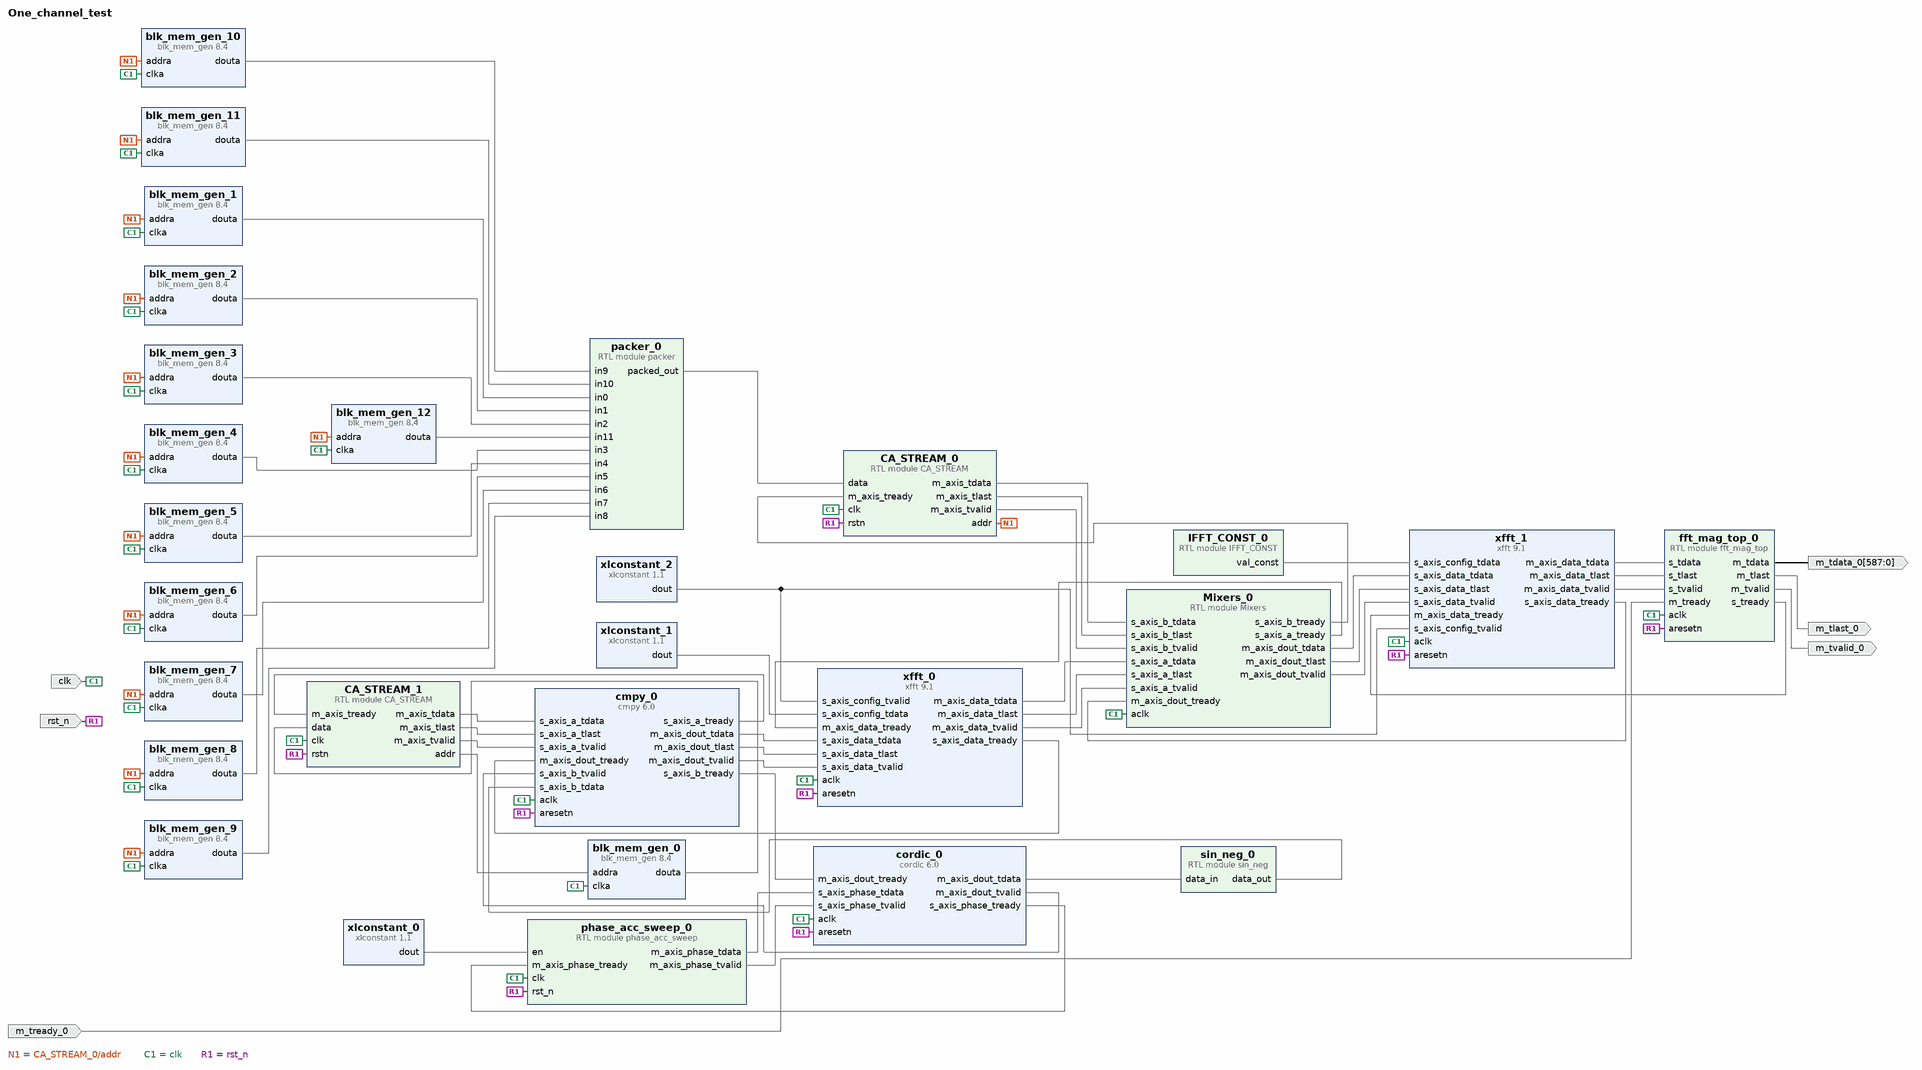
[diagram p0: block diagram of the top level]
# Vivado block design One_channel_test, xc7z020clg400-1, Vivado 2025.2
create_bd_design One_channel_test

create_bd_port -dir I -type clk clk
set_property -dict {CONFIG.FREQ_HZ 125000000} [get_bd_ports clk]
create_bd_port -dir I -type rst rst_n
create_bd_port -dir O m_tvalid_0
create_bd_port -dir O m_tlast_0
create_bd_port -dir O -from 587 -to 0 m_tdata_0
create_bd_port -dir I m_tready_0

create_bd_cell -type module -reference CA_STREAM CA_STREAM_1
set_property -dict {CONFIG.NUM_CHANNELS 1} [get_bd_cells CA_STREAM_1]
create_bd_cell -type module -reference IFFT_CONST IFFT_CONST_0
create_bd_cell -type module -reference Mixers Mixers_0
create_bd_cell -type ip -vlnv xilinx.com:ip:blk_mem_gen:8.4 blk_mem_gen_0
set_property -dict [list \
  CONFIG.Coe_File d:/fft_core/signal_iq.coe \
  CONFIG.Enable_A Always_Enabled \
  CONFIG.Load_Init_File true \
  CONFIG.Memory_Type Single_Port_ROM \
  CONFIG.Write_Depth_A 2048 \
  CONFIG.Write_Width_A 16 \
  CONFIG.use_bram_block Stand_Alone \
] [get_bd_cells blk_mem_gen_0]
create_bd_cell -type ip -vlnv xilinx.com:ip:cmpy:6.0 cmpy_0
set_property -dict [list \
  CONFIG.APortWidth 8 \
  CONFIG.ARESETN true \
  CONFIG.BPortWidth 8 \
  CONFIG.FlowControl Blocking \
  CONFIG.HasATLAST true \
  CONFIG.HasBTLAST false \
  CONFIG.MinimumLatency 7 \
  CONFIG.MultType Force_Mults \
  CONFIG.OutTLASTBehv Pass_A_TLAST \
  CONFIG.OutputWidth 17 \
] [get_bd_cells cmpy_0]
create_bd_cell -type ip -vlnv xilinx.com:ip:cordic:6.0 cordic_0
set_property -dict [list \
  CONFIG.ARESETN true \
  CONFIG.Data_Format SignedFraction \
  CONFIG.Functional_Selection Sin_and_Cos \
  CONFIG.Input_Width 16 \
  CONFIG.Output_Width 8 \
  CONFIG.Phase_Format Scaled_Radians \
  CONFIG.Round_Mode Round_Pos_Inf \
  CONFIG.flow_control Blocking \
  CONFIG.out_tlast_behv Null \
  CONFIG.out_tready true \
  CONFIG.phase_has_tlast false \
] [get_bd_cells cordic_0]
create_bd_cell -type module -reference fft_mag_top fft_mag_top_0
set_property -dict {CONFIG.MODE 1} [get_bd_cells fft_mag_top_0]
create_bd_cell -type module -reference phase_acc_sweep phase_acc_sweep_0
set_property -dict [list \
  CONFIG.F_SAMPLE_HZ 2046000 \
  CONFIG.F_START_HZ -5000 \
  CONFIG.F_STEP_HZ 1000 \
  CONFIG.F_STOP_HZ 5000 \
  CONFIG.SWEEP_INTERVAL 2048 \
] [get_bd_cells phase_acc_sweep_0]
create_bd_cell -type module -reference sin_neg sin_neg_0
create_bd_cell -type ip -vlnv xilinx.com:ip:xfft:9.1 xfft_0
set_property -dict [list \
  CONFIG.aresetn true \
  CONFIG.butterfly_type use_luts \
  CONFIG.complex_mult_type use_mults_resources \
  CONFIG.implementation_options radix_4_burst_io \
  CONFIG.input_width 17 \
  CONFIG.number_of_stages_using_block_ram_for_data_and_phase_factors 0 \
  CONFIG.output_ordering natural_order \
  CONFIG.phase_factor_width 17 \
  CONFIG.rounding_modes convergent_rounding \
  CONFIG.super_sample_rates 1 \
  CONFIG.target_clock_frequency 125 \
  CONFIG.transform_length 2048 \
] [get_bd_cells xfft_0]
create_bd_cell -type ip -vlnv xilinx.com:ip:xfft:9.1 xfft_1
set_property -dict [list \
  CONFIG.aresetn true \
  CONFIG.channels 12 \
  CONFIG.complex_mult_type use_mults_resources \
  CONFIG.implementation_options radix_2_lite_burst_io \
  CONFIG.input_width 24 \
  CONFIG.number_of_stages_using_block_ram_for_data_and_phase_factors 0 \
  CONFIG.output_ordering natural_order \
  CONFIG.phase_factor_width 24 \
  CONFIG.rounding_modes convergent_rounding \
  CONFIG.super_sample_rates 1 \
  CONFIG.target_clock_frequency 125 \
  CONFIG.target_data_throughput 50 \
  CONFIG.transform_length 2048 \
] [get_bd_cells xfft_1]
create_bd_cell -type ip -vlnv xilinx.com:ip:xlconstant:1.1 xlconstant_0
create_bd_cell -type ip -vlnv xilinx.com:ip:xlconstant:1.1 xlconstant_1
set_property -dict {CONFIG.CONST_VAL b0000000000101011 CONFIG.CONST_WIDTH 16} [get_bd_cells xlconstant_1]
create_bd_cell -type ip -vlnv xilinx.com:ip:xlconstant:1.1 xlconstant_2
create_bd_cell -type module -reference CA_STREAM CA_STREAM_0
set_property -dict {CONFIG.NUM_CHANNELS 12} [get_bd_cells CA_STREAM_0]
create_bd_cell -type ip -vlnv xilinx.com:ip:blk_mem_gen:8.4 blk_mem_gen_1
set_property -dict [list \
  CONFIG.Coe_File d:/fft_core/ca_code_prn01.coe \
  CONFIG.Enable_A Always_Enabled \
  CONFIG.Load_Init_File true \
  CONFIG.Memory_Type Single_Port_ROM \
  CONFIG.Write_Depth_A 2048 \
  CONFIG.Write_Width_A 16 \
  CONFIG.use_bram_block Stand_Alone \
] [get_bd_cells blk_mem_gen_1]
create_bd_cell -type ip -vlnv xilinx.com:ip:blk_mem_gen:8.4 blk_mem_gen_10
set_property -dict [list \
  CONFIG.Coe_File d:/fft_core/ca_code_prn23.coe \
  CONFIG.Enable_A Always_Enabled \
  CONFIG.Load_Init_File true \
  CONFIG.Memory_Type Single_Port_ROM \
  CONFIG.Write_Depth_A 2048 \
  CONFIG.Write_Width_A 16 \
  CONFIG.use_bram_block Stand_Alone \
] [get_bd_cells blk_mem_gen_10]
create_bd_cell -type ip -vlnv xilinx.com:ip:blk_mem_gen:8.4 blk_mem_gen_11
set_property -dict [list \
  CONFIG.Coe_File d:/fft_core/ca_code_prn27.coe \
  CONFIG.Enable_A Always_Enabled \
  CONFIG.Load_Init_File true \
  CONFIG.Memory_Type Single_Port_ROM \
  CONFIG.Write_Depth_A 2048 \
  CONFIG.Write_Width_A 16 \
  CONFIG.use_bram_block Stand_Alone \
] [get_bd_cells blk_mem_gen_11]
create_bd_cell -type ip -vlnv xilinx.com:ip:blk_mem_gen:8.4 blk_mem_gen_12
set_property -dict [list \
  CONFIG.Coe_File d:/fft_core/ca_code_prn30.coe \
  CONFIG.Enable_A Always_Enabled \
  CONFIG.Load_Init_File true \
  CONFIG.Memory_Type Single_Port_ROM \
  CONFIG.Write_Depth_A 2048 \
  CONFIG.Write_Width_A 16 \
  CONFIG.use_bram_block Stand_Alone \
] [get_bd_cells blk_mem_gen_12]
create_bd_cell -type ip -vlnv xilinx.com:ip:blk_mem_gen:8.4 blk_mem_gen_2
set_property -dict [list \
  CONFIG.Coe_File d:/fft_core/ca_code_prn07.coe \
  CONFIG.Enable_A Always_Enabled \
  CONFIG.Load_Init_File true \
  CONFIG.Memory_Type Single_Port_ROM \
  CONFIG.Write_Depth_A 2048 \
  CONFIG.Write_Width_A 16 \
  CONFIG.use_bram_block Stand_Alone \
] [get_bd_cells blk_mem_gen_2]
create_bd_cell -type ip -vlnv xilinx.com:ip:blk_mem_gen:8.4 blk_mem_gen_3
set_property -dict [list \
  CONFIG.Coe_File d:/fft_core/ca_code_prn08.coe \
  CONFIG.Enable_A Always_Enabled \
  CONFIG.Load_Init_File true \
  CONFIG.Memory_Type Single_Port_ROM \
  CONFIG.Write_Depth_A 2048 \
  CONFIG.Write_Width_A 16 \
  CONFIG.use_bram_block Stand_Alone \
] [get_bd_cells blk_mem_gen_3]
create_bd_cell -type ip -vlnv xilinx.com:ip:blk_mem_gen:8.4 blk_mem_gen_4
set_property -dict [list \
  CONFIG.Coe_File d:/fft_core/ca_code_prn10.coe \
  CONFIG.Enable_A Always_Enabled \
  CONFIG.Load_Init_File true \
  CONFIG.Memory_Type Single_Port_ROM \
  CONFIG.Write_Depth_A 2048 \
  CONFIG.Write_Width_A 16 \
  CONFIG.use_bram_block Stand_Alone \
] [get_bd_cells blk_mem_gen_4]
create_bd_cell -type ip -vlnv xilinx.com:ip:blk_mem_gen:8.4 blk_mem_gen_5
set_property -dict [list \
  CONFIG.Coe_File d:/fft_core/ca_code_prn14.coe \
  CONFIG.Enable_A Always_Enabled \
  CONFIG.Load_Init_File true \
  CONFIG.Memory_Type Single_Port_ROM \
  CONFIG.Write_Depth_A 2048 \
  CONFIG.Write_Width_A 16 \
  CONFIG.use_bram_block Stand_Alone \
] [get_bd_cells blk_mem_gen_5]
create_bd_cell -type ip -vlnv xilinx.com:ip:blk_mem_gen:8.4 blk_mem_gen_6
set_property -dict [list \
  CONFIG.Coe_File d:/fft_core/ca_code_prn15.coe \
  CONFIG.Enable_A Always_Enabled \
  CONFIG.Load_Init_File true \
  CONFIG.Memory_Type Single_Port_ROM \
  CONFIG.Write_Depth_A 2048 \
  CONFIG.Write_Width_A 16 \
  CONFIG.use_bram_block Stand_Alone \
] [get_bd_cells blk_mem_gen_6]
create_bd_cell -type ip -vlnv xilinx.com:ip:blk_mem_gen:8.4 blk_mem_gen_7
set_property -dict [list \
  CONFIG.Coe_File d:/fft_core/ca_code_prn16.coe \
  CONFIG.Enable_A Always_Enabled \
  CONFIG.Load_Init_File true \
  CONFIG.Memory_Type Single_Port_ROM \
  CONFIG.Write_Depth_A 2048 \
  CONFIG.Write_Width_A 16 \
  CONFIG.use_bram_block Stand_Alone \
] [get_bd_cells blk_mem_gen_7]
create_bd_cell -type ip -vlnv xilinx.com:ip:blk_mem_gen:8.4 blk_mem_gen_8
set_property -dict [list \
  CONFIG.Coe_File d:/fft_core/ca_code_prn21.coe \
  CONFIG.Enable_A Always_Enabled \
  CONFIG.Load_Init_File true \
  CONFIG.Memory_Type Single_Port_ROM \
  CONFIG.Write_Depth_A 2048 \
  CONFIG.Write_Width_A 16 \
  CONFIG.use_bram_block Stand_Alone \
] [get_bd_cells blk_mem_gen_8]
create_bd_cell -type ip -vlnv xilinx.com:ip:blk_mem_gen:8.4 blk_mem_gen_9
set_property -dict [list \
  CONFIG.Coe_File d:/fft_core/ca_code_prn22.coe \
  CONFIG.Enable_A Always_Enabled \
  CONFIG.Load_Init_File true \
  CONFIG.Memory_Type Single_Port_ROM \
  CONFIG.Write_Depth_A 2048 \
  CONFIG.Write_Width_A 16 \
  CONFIG.use_bram_block Stand_Alone \
] [get_bd_cells blk_mem_gen_9]
create_bd_cell -type module -reference packer packer_0

# ---- connections ----

connect_bd_net [get_bd_pins CA_STREAM_0/addr] \
  [get_bd_pins blk_mem_gen_1/addra] [get_bd_pins blk_mem_gen_8/addra] [get_bd_pins blk_mem_gen_2/addra] \
  [get_bd_pins blk_mem_gen_9/addra] [get_bd_pins blk_mem_gen_10/addra] [get_bd_pins blk_mem_gen_3/addra] \
  [get_bd_pins blk_mem_gen_4/addra] [get_bd_pins blk_mem_gen_11/addra] [get_bd_pins blk_mem_gen_5/addra] \
  [get_bd_pins blk_mem_gen_6/addra] [get_bd_pins blk_mem_gen_12/addra] [get_bd_pins blk_mem_gen_7/addra]
connect_bd_net [get_bd_pins CA_STREAM_0/m_axis_tdata] [get_bd_pins Mixers_0/s_axis_b_tdata]
connect_bd_net [get_bd_pins CA_STREAM_0/m_axis_tlast] [get_bd_pins Mixers_0/s_axis_b_tlast]
connect_bd_net [get_bd_pins CA_STREAM_0/m_axis_tvalid] [get_bd_pins Mixers_0/s_axis_b_tvalid]
connect_bd_net [get_bd_pins CA_STREAM_1/addr] [get_bd_pins blk_mem_gen_0/addra]
connect_bd_net [get_bd_pins CA_STREAM_1/m_axis_tdata] [get_bd_pins cmpy_0/s_axis_a_tdata]
connect_bd_net [get_bd_pins CA_STREAM_1/m_axis_tlast] [get_bd_pins cmpy_0/s_axis_a_tlast]
connect_bd_net [get_bd_pins CA_STREAM_1/m_axis_tvalid] [get_bd_pins cmpy_0/s_axis_a_tvalid]
connect_bd_net -net IFFT_CONST_0_constant [get_bd_pins IFFT_CONST_0/val_const] [get_bd_pins xfft_1/s_axis_config_tdata]
connect_bd_net [get_bd_pins Mixers_0/m_axis_dout_tdata] [get_bd_pins xfft_1/s_axis_data_tdata]
connect_bd_net [get_bd_pins Mixers_0/m_axis_dout_tlast] [get_bd_pins xfft_1/s_axis_data_tlast]
connect_bd_net [get_bd_pins Mixers_0/m_axis_dout_tvalid] [get_bd_pins xfft_1/s_axis_data_tvalid]
connect_bd_net [get_bd_pins Mixers_0/s_axis_a_tready] [get_bd_pins xfft_0/m_axis_data_tready]
connect_bd_net [get_bd_pins Mixers_0/s_axis_b_tready] [get_bd_pins CA_STREAM_0/m_axis_tready]
connect_bd_net [get_bd_ports clk] \
  [get_bd_pins blk_mem_gen_0/clka] [get_bd_pins cordic_0/aclk] [get_bd_pins cmpy_0/aclk] [get_bd_pins xfft_0/aclk] \
  [get_bd_pins xfft_1/aclk] [get_bd_pins CA_STREAM_1/clk] [get_bd_pins Mixers_0/aclk] [get_bd_pins phase_acc_sweep_0/clk] \
  [get_bd_pins blk_mem_gen_1/clka] [get_bd_pins blk_mem_gen_8/clka] [get_bd_pins blk_mem_gen_9/clka] \
  [get_bd_pins blk_mem_gen_2/clka] [get_bd_pins blk_mem_gen_3/clka] [get_bd_pins blk_mem_gen_10/clka] \
  [get_bd_pins blk_mem_gen_11/clka] [get_bd_pins blk_mem_gen_4/clka] [get_bd_pins blk_mem_gen_5/clka] \
  [get_bd_pins blk_mem_gen_12/clka] [get_bd_pins blk_mem_gen_6/clka] [get_bd_pins blk_mem_gen_7/clka] \
  [get_bd_pins CA_STREAM_0/clk] [get_bd_pins fft_mag_top_0/aclk]
connect_bd_net [get_bd_ports rst_n] \
  [get_bd_pins cordic_0/aresetn] [get_bd_pins cmpy_0/aresetn] [get_bd_pins xfft_0/aresetn] [get_bd_pins xfft_1/aresetn] \
  [get_bd_pins CA_STREAM_1/rstn] [get_bd_pins phase_acc_sweep_0/rst_n] [get_bd_pins CA_STREAM_0/rstn] \
  [get_bd_pins fft_mag_top_0/aresetn]
connect_bd_net [get_bd_pins blk_mem_gen_0/douta] [get_bd_pins CA_STREAM_1/data]
connect_bd_net [get_bd_pins blk_mem_gen_10/douta] [get_bd_pins packer_0/in9]
connect_bd_net [get_bd_pins blk_mem_gen_11/douta] [get_bd_pins packer_0/in10]
connect_bd_net [get_bd_pins blk_mem_gen_12/douta] [get_bd_pins packer_0/in11]
connect_bd_net [get_bd_pins blk_mem_gen_1/douta] [get_bd_pins packer_0/in0]
connect_bd_net [get_bd_pins blk_mem_gen_2/douta] [get_bd_pins packer_0/in1]
connect_bd_net [get_bd_pins blk_mem_gen_3/douta] [get_bd_pins packer_0/in2]
connect_bd_net [get_bd_pins blk_mem_gen_4/douta] [get_bd_pins packer_0/in3]
connect_bd_net [get_bd_pins blk_mem_gen_5/douta] [get_bd_pins packer_0/in4]
connect_bd_net [get_bd_pins blk_mem_gen_6/douta] [get_bd_pins packer_0/in5]
connect_bd_net [get_bd_pins blk_mem_gen_7/douta] [get_bd_pins packer_0/in6]
connect_bd_net [get_bd_pins blk_mem_gen_8/douta] [get_bd_pins packer_0/in7]
connect_bd_net [get_bd_pins blk_mem_gen_9/douta] [get_bd_pins packer_0/in8]
connect_bd_net [get_bd_pins cmpy_0/m_axis_dout_tdata] [get_bd_pins xfft_0/s_axis_data_tdata]
connect_bd_net [get_bd_pins cmpy_0/m_axis_dout_tlast] [get_bd_pins xfft_0/s_axis_data_tlast]
connect_bd_net [get_bd_pins cmpy_0/m_axis_dout_tvalid] [get_bd_pins xfft_0/s_axis_data_tvalid]
connect_bd_net [get_bd_pins cmpy_0/s_axis_a_tready] [get_bd_pins CA_STREAM_1/m_axis_tready]
connect_bd_net [get_bd_pins cmpy_0/s_axis_b_tready] [get_bd_pins cordic_0/m_axis_dout_tready]
connect_bd_net [get_bd_pins cordic_0/m_axis_dout_tdata] [get_bd_pins sin_neg_0/data_in]
connect_bd_net [get_bd_pins cordic_0/m_axis_dout_tvalid] [get_bd_pins cmpy_0/s_axis_b_tvalid]
connect_bd_net [get_bd_pins cordic_0/s_axis_phase_tready] [get_bd_pins phase_acc_sweep_0/m_axis_phase_tready]
connect_bd_net [get_bd_pins fft_mag_top_0/m_tdata] [get_bd_ports m_tdata_0]
connect_bd_net [get_bd_pins fft_mag_top_0/m_tlast] [get_bd_ports m_tlast_0]
connect_bd_net [get_bd_pins fft_mag_top_0/m_tvalid] [get_bd_ports m_tvalid_0]
connect_bd_net [get_bd_pins fft_mag_top_0/s_tready] [get_bd_pins xfft_1/m_axis_data_tready]
connect_bd_net -net m_tready_0_1 [get_bd_ports m_tready_0] [get_bd_pins fft_mag_top_0/m_tready]
connect_bd_net [get_bd_pins packer_0/packed_out] [get_bd_pins CA_STREAM_0/data]
connect_bd_net [get_bd_pins phase_acc_sweep_0/m_axis_phase_tdata] [get_bd_pins cordic_0/s_axis_phase_tdata]
connect_bd_net [get_bd_pins phase_acc_sweep_0/m_axis_phase_tvalid] [get_bd_pins cordic_0/s_axis_phase_tvalid]
connect_bd_net [get_bd_pins sin_neg_0/data_out] [get_bd_pins cmpy_0/s_axis_b_tdata]
connect_bd_net [get_bd_pins xfft_0/m_axis_data_tdata] [get_bd_pins Mixers_0/s_axis_a_tdata]
connect_bd_net [get_bd_pins xfft_0/m_axis_data_tlast] [get_bd_pins Mixers_0/s_axis_a_tlast]
connect_bd_net [get_bd_pins xfft_0/m_axis_data_tvalid] [get_bd_pins Mixers_0/s_axis_a_tvalid]
connect_bd_net [get_bd_pins xfft_0/s_axis_data_tready] [get_bd_pins cmpy_0/m_axis_dout_tready]
connect_bd_net [get_bd_pins xfft_1/m_axis_data_tdata] [get_bd_pins fft_mag_top_0/s_tdata]
connect_bd_net [get_bd_pins xfft_1/m_axis_data_tlast] [get_bd_pins fft_mag_top_0/s_tlast]
connect_bd_net [get_bd_pins xfft_1/m_axis_data_tvalid] [get_bd_pins fft_mag_top_0/s_tvalid]
connect_bd_net [get_bd_pins xfft_1/s_axis_data_tready] [get_bd_pins Mixers_0/m_axis_dout_tready]
connect_bd_net [get_bd_pins xlconstant_0/dout] [get_bd_pins phase_acc_sweep_0/en]
connect_bd_net [get_bd_pins xlconstant_1/dout] [get_bd_pins xfft_0/s_axis_config_tdata]
connect_bd_net [get_bd_pins xlconstant_2/dout] [get_bd_pins xfft_0/s_axis_config_tvalid] [get_bd_pins xfft_1/s_axis_config_tvalid]

validate_bd_design
save_bd_design
